# EAGLE design rp2040 (EAGLE 9.5.1)
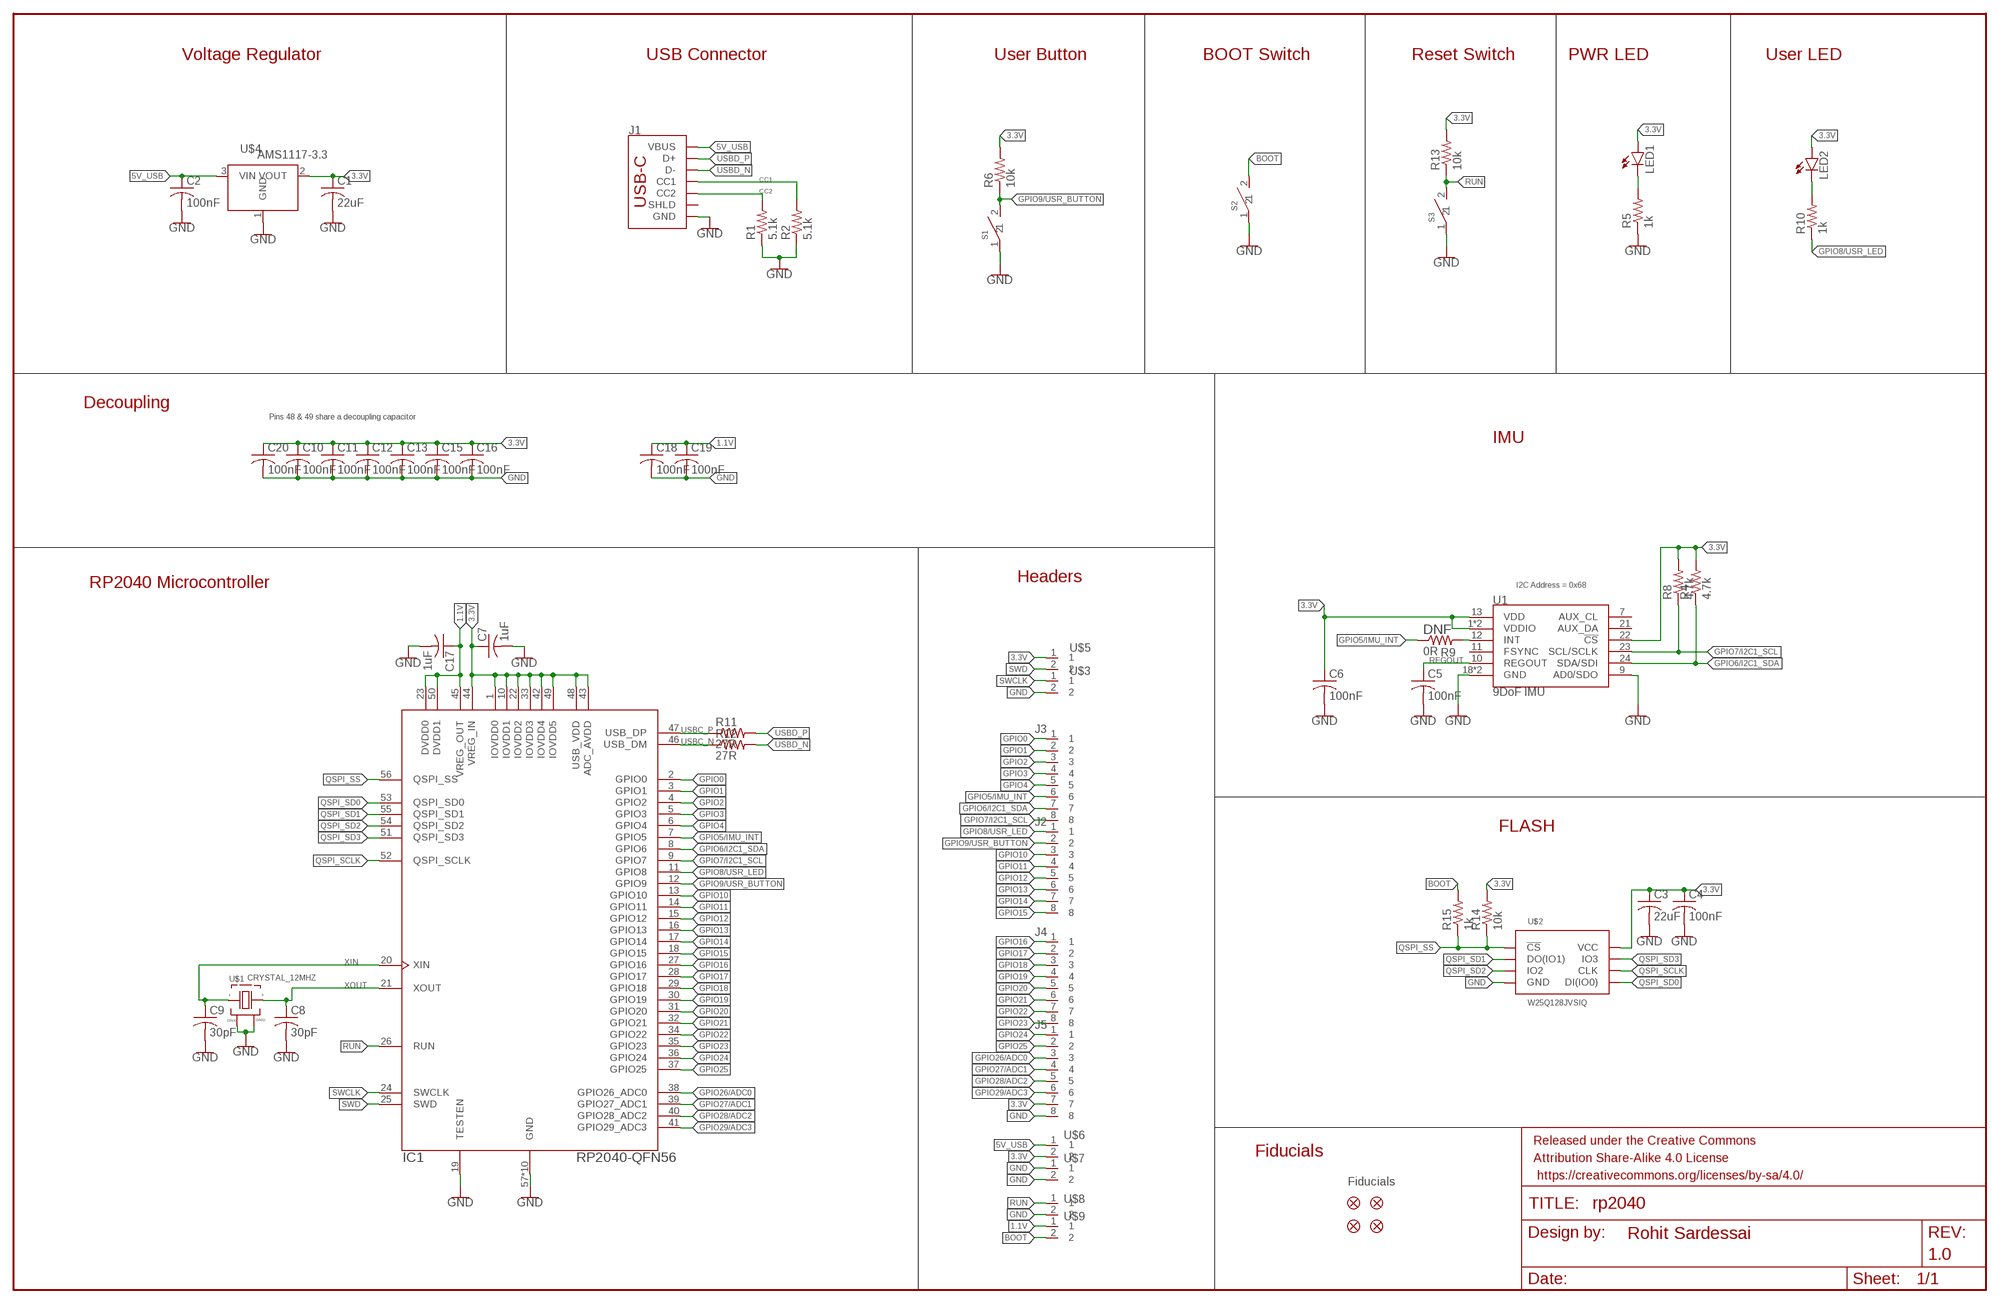
[diagram p0: schematic, sheet 1]

## Parts
C1  22uF  C-USC0603  [C0603]
C2  100nF  C-USC0603  [C0603]
C3  22uF  C-USC0402  [C0402]
C4  100nF  C-USC0402  [C0402]
C5  100nF  C-USC0402  [C0402]
C6  100nF  C-USC0402  [C0402]
C7  1uF  C-USC0402  [C0402]
C8  30pF  C-USC0402  [C0402]
C9  30pF  C-USC0402  [C0402]
C10  100nF  C-USC0402  [C0402]
C11  100nF  C-USC0402  [C0402]
C12  100nF  C-USC0402  [C0402]
C13  100nF  C-USC0402  [C0402]
C15  100nF  C-USC0402  [C0402]
C16  100nF  C-USC0402  [C0402]
C17  1uF  C-USC0402  [C0402]
C18  100nF  C-USC0402  [C0402]
C19  100nF  C-USC0402  [C0402]
C20  100nF  C-USC0402  [C0402]
FD1  FIDUCIAL1X2  [FIDUCIAL-1X2]
FD2  FIDUCIAL1X2  [FIDUCIAL-1X2]
FD3  FIDUCIAL1X2  [FIDUCIAL-1X2]
FD4  FIDUCIAL1X2  [FIDUCIAL-1X2]
FRAME1  FRAME-LEDGERNO_FOOTPRINT  [DUMMY]
IC1  RP2040-QFN56  [RP2040-QFN-56]
J1  USB_C_4-LAYER_PADS  [USB-C-16P_4LAYER-PADS]
J2  1X6_2.5MM  [1X06_2.5MM]
J3  1X6_2.5MM  [1X06_2.5MM]
J4  1X6_2.5MM  [1X06_2.5MM]
J5  1X6_2.5MM  [1X06_2.5MM]
LED1  LEDCHIPLED_0603  [CHIPLED_0603]
LED2  LEDCHIPLED_0603  [CHIPLED_0603]
R1  5.1k  R-US_R0402  [R0402]
R2  5.1k  R-US_R0402  [R0402]
R4  4.7k  R-US_R0402  [R0402]
R5  1k  R-US_R0402  [R0402]
R6  10k  R-US_R0402  [R0402]
R8  4.7k  R-US_R0402  [R0402]
R9  0R  R-US_R0402  [R0402]
R10  1k  R-US_R0402  [R0402]
R11  27R  R-US_R0402  [R0402]
R12  27R  R-US_R0402  [R0402]
R13  10k  R-US_R0402  [R0402]
R14  10k  R-US_R0402  [R0402]
R15  1k  R-US_R0402  [R0402]
S1  TS-1088-AR02016  [PUSH_SW_SMD]
S2  TS-1088-AR02016  [PUSH_SW_SMD]
S3  TS-1088-AR02016  [PUSH_SW_SMD]
U1  9DoF IMU  MPU-9250  [QFN24-3X3]
U$1  CRYSTAL_12MHZ  [CRYSTAL_12MHZ]
U$2  W25Q128JVSIQ  [SOIC8-208MIL]
U$3  1X2_2.5MM  [1X02_2.5MM]
U$4  AMS1117-3.3  [SOT-223]
U$5  1X2_2.5MM  [1X02_2.5MM]
U$6  1X2_2.5MM  [1X02_2.5MM]
U$7  1X2_2.5MM  [1X02_2.5MM]
U$8  1X2_2.5MM  [1X02_2.5MM]
U$9  1X2_2.5MM  [1X02_2.5MM]

## Nets
1.1V: C17.1 C18.1 C19.1 IC1.23(DVDD0) IC1.45(VREG_OUT) IC1.50(DVDD1) U$9.1
3.3V: C1.1 C3.1 C4.1 C6.1 C7.1 C10.1 C11.1 C12.1 C13.1 C15.1 C16.1 C20.1 IC1.1(IOVDD0) IC1.10(IOVDD1) IC1.22(IOVDD2) IC1.33(IOVDD3) IC1.42(IOVDD4) IC1.43(ADC_AVDD) IC1.44(VREG_IN) IC1.48(USB_VDD) IC1.49(IOVDD5) J5.7 LED1.A LED2.A R4.2 R6.2 R8.2 R13.2 R14.2 U1.1(VDDIO) U1.8(VDDIO) U1.13(VDD) U1.22(!CS) U$2.8(VCC) U$4.2(VOUT) U$5.1 U$6.2
5V_USB: C2.1 J1.VBUS1(VBUS) J1.VBUS2(VBUS) U$4.3(VIN) U$6.1
BOOT: R15.2 S2.2 U$9.2
CC1: J1.A5(CC1) R2.2
CC2: J1.B5(CC2) R1.2
GND: C1.2 C2.2 C3.2 C4.2 C5.2 C6.2 C7.2 C8.2 C9.2 C10.2 C11.2 C12.2 C13.2 C15.2 C16.2 C17.2 C18.2 C19.2 C20.2 IC1.19(TESTEN) IC1.57(GND) IC1.58(GND) IC1.59(GND) IC1.60(GND) IC1.61(GND) IC1.62(GND) IC1.63(GND) IC1.64(GND) IC1.65(GND) IC1.66(GND) J1.GND J1.GND2(GND) J5.8 R1.1 R2.1 R5.1 S1.1 S2.1 S3.1 U1.9(AD0/SDO) U1.18(GND) U1.20(GND) U$1.2(GND) U$1.4(GND) U$2.4(GND) U$3.2 U$4.1(GND) U$7.1 U$7.2 U$8.2
GPIO0: IC1.2(GPIO0) J3.1
GPIO1: IC1.3(GPIO1) J3.2
GPIO2: IC1.4(GPIO2) J3.3
GPIO3: IC1.5(GPIO3) J3.4
GPIO4: IC1.6(GPIO4) J3.5
GPIO5/IMU_INT: IC1.7(GPIO5) J3.6 R9.1
GPIO6/I2C1_SDA: IC1.8(GPIO6) J3.7 R4.1 U1.24(SDA/SDI)
GPIO7/I2C1_SCL: IC1.9(GPIO7) J3.8 R8.1 U1.23(SCL/SCLK)
GPIO8/USR_LED: IC1.11(GPIO8) J2.1 R10.1
GPIO9/USR_BUTTON: IC1.12(GPIO9) J2.2 R6.1 S1.2
GPIO10: IC1.13(GPIO10) J2.3
GPIO11: IC1.14(GPIO11) J2.4
GPIO12: IC1.15(GPIO12) J2.5
GPIO13: IC1.16(GPIO13) J2.6
GPIO14: IC1.17(GPIO14) J2.7
GPIO15: IC1.18(GPIO15) J2.8
GPIO16: IC1.27(GPIO16) J4.1
GPIO17: IC1.28(GPIO17) J4.2
GPIO18: IC1.29(GPIO18) J4.3
GPIO19: IC1.30(GPIO19) J4.4
GPIO20: IC1.31(GPIO20) J4.5
GPIO21: IC1.32(GPIO21) J4.6
GPIO22: IC1.34(GPIO22) J4.7
GPIO23: IC1.35(GPIO23) J4.8
GPIO24: IC1.36(GPIO24) J5.1
GPIO25: IC1.37(GPIO25) J5.2
GPIO26/ADC0: IC1.38(GPIO26_ADC0) J5.3
GPIO27/ADC1: IC1.39(GPIO27_ADC1) J5.4
GPIO28/ADC2: IC1.40(GPIO28_ADC2) J5.5
GPIO29/ADC3: IC1.41(GPIO29_ADC3) J5.6
N$1: LED1.C R5.2
N$5: R9.2 U1.12(INT)
N$6: LED2.C R10.2
QSPI_SCLK: IC1.52(QSPI_SCLK) U$2.6(CLK)
QSPI_SD0: IC1.53(QSPI_SD0) U$2.5(DI(IO0))
QSPI_SD1: IC1.55(QSPI_SD1) U$2.2(DO(IO1))
QSPI_SD2: IC1.54(QSPI_SD2) U$2.3(IO2)
QSPI_SD3: IC1.51(QSPI_SD3) U$2.7(IO3)
QSPI_SS: IC1.56(QSPI_SS) R14.1 R15.1 U$2.1(!CS)
REGOUT: C5.1 U1.10(REGOUT)
RUN: IC1.26(RUN) R13.1 S3.2 U$8.1
SWCLK: IC1.24(SWCLK) U$3.1
SWD: IC1.25(SWD) U$5.2
USBC_N: IC1.46(USB_DM) R12.1
USBC_P: IC1.47(USB_DP) R11.1
USBD_N: J1.A7(D-) J1.B7(D-) R12.2
USBD_P: J1.A6(D+) J1.B6(D+) R11.2
XIN: C9.1 IC1.20(XIN) U$1.1
XOUT: C8.1 IC1.21(XOUT) U$1.3
Unconnected: J1.SHLD1(SHLD) J1.SHLD2(SHLD) J1.SHLD3(SHLD) J1.SHLD4(SHLD) U1.7(AUX_CL) U1.11(FSYNC) U1.21(AUX_DA)

## Notes on the sheet
- Voltage Regulator | USB Connector | User Button | BOOT Switch | Reset Switch | PWR LED | User LED
- Decoupling
- Pins 48 & 49 share a decoupling capacitor
- IMU
- Headers
- RP2040 Microcontroller | I2C Address = 0x68
- DNF
- FLASH
- Fiducials
- Fiducials

## Library data of the parts
C1-C13 C15-C20 = rcl:C-US: CAPACITOR, American symbol; SPICEPREFIX: C
FD1-FD4 = SparkFun-Aesthetics:FIDUCIAL: Fiducial Alignment Points Point-of-reference for pick-and-place machines and other optical instruments.
FRAME1 = SparkFun-Aesthetics:FRAME-LEDGER: Schematic Frame - Ledger Standard 11x14 US Ledger frame; DESIGNER: Rohit Sardessai; REV: 1.0
IC1 = RPipico:RP2040-QFN56
J1 = SparkFun-Connectors:USB_C: USB Type C 16Pin Connector Super Speed pins not available on the 16-pin purely SMD connector so this part is best for USB 2.0 implementations. D1 and D2 are tied together enabling D+/- no matter which way the cable is plugged into the connector. The two channel configuration pins (CC1/2) are exposed. These are normally connected to ground via 5.1k resistors but can be reconfigured for high current/high power applications. **4-LAYER BOARD WARNING!!** If designing 4-layer board, make sure to select the variant _4-LAYER-ISOLATED. The linked footprint (USB-C-16-4LAYER-ISOLATED) includes some very necessary cutout polygons in the inner layers (2 and 15). This prevents the PTH mounting shield legs on the USB connector from electrically connecting any other polygons on the inner layers (usually VCC and GND).; PROD_ID: CONN-14122
J2-J5 = rp2040:1X6_2.5MM: 1 x 6 2.5mm pitch: 2.54 mm Castellated Holes
LED1 LED2 = led:LED: LED OSRAM: - CHIPLED LG R971, LG N971, LY N971, LG Q971, LY Q971, LO R971, LY R971 LH N974, LH R974 LS Q976, LO Q976, LY Q976 LO Q996 - Hyper CHIPLED LW Q18S LB Q993, LB Q99A, LB R99A - SideLED LS A670, LO A670, LY A670, LG A670, LP A670 LB A673, LV A673, LT A673, LW A673 LH A674 LY A675 LS A676, LA A676, LO A676, LY A676, LW A676 LS A679, LY A679, LG A679 - Hyper Micro SIDELED® LS Y876, LA Y876, LO Y876, LY Y876 LT Y87S - SmartLED LW L88C, LW L88S LB L89C, LB L89S, LG L890 LS L89K, LO L89K, LY L89K LS L896, LA L896, LO L896, LY L896 - TOPLED LS T670, LO T670, LY T670, LG T670, LP T670 LSG T670, LSP T670, LSY T670, LOP T670, LYG T670 LG T671, LOG T671, LSG T671 LB T673, LV T673, LT T673, LW T673 LH T674 LS T676, LA T676, LO T676, LY T676, LB T676, LH T676, LSB T676, LW T676 LB T67C, LV T67C, LT T67C, LS T67K, LO T67K, LY T67K, LW E67C LS E67B, LA E67B, LO E67B, LY E67B, LB E67C, LV E67C, LT E67C LW T67C LS T679, LY T679, LG T679 LS T770, LO T770, LY T770, LG T770, LP T770 LB T773, LV T773, LT T773, LW T773 LH T774 LS E675, LA E675, LY E675, LS T675 LS T776, LA T776, LO T776, LY T776, LB T776 LHGB T686 LT T68C, LB T68C - Hyper Mini TOPLED® LB M676 - Mini TOPLED Santana® LG M470 LS M47K, LO M47K, LY M47K Source: http://www.osram.convergy.de LUXEON: - LUMILED® LXK2-PW12-R00, LXK2-PW12-S00, LXK2-PW14-U00, LXK2-PW14-V00 LXK2-PM12-R00, LXK2-PM12-S00, LXK2-PM14-U00 LXK2-PE12-Q00, LXK2-PE12-R00, LXK2-PE12-S00, LXK2-PE14-T00, LXK2-PE14-U00 LXK2-PB12-K00, LXK2-PB12-L00, LXK2-PB12-M00, LXK2-PB14-N00, LXK2-PB14-P00, LXK2-PB14-Q00 LXK2-PR12-L00, LXK2-PR12-M00, LXK2-PR14-Q00, LXK2-PR14-R00 LXK2-PD12-Q00, LXK2-PD12-R00, LXK2-PD12-S00 LXK2-PH12-R00, LXK2-PH12-S00 LXK2-PL12-P00, LXK2-PL12-Q00, LXK2-PL12-R00 Source: www.luxeon.com KINGBRIGHT: KA-3528ASYC Source: www.kingbright.com
R1 R2 R4-R6 R8-R15 = rcl:R-US_: RESISTOR, American symbol; SPICEPREFIX: R
S1-S3 = rp2040:TS-1088-AR02016: Tactile Switch Push Button, SMD Manufacturer: XUNPU MFR.Part: #TS-1088-AR02016 JLCPCB Part: #C720477 Package: SMD_3×4×2.0 Description: SMD,3×4×2.0mm Tactile Switches ROHS Datasheet <https://datasheet.lcsc.com/lcsc/2008221234_XUNPU-TS-1088-AR02016_C720477.pdf>
U1 = SparkFun-Sensors:MPU-9250: MPU-9250 9 Degree of Freedom IMU System in Package that contains MPU-6500 & AK8963 NC pin 19. 2-6 & 14-17 not internally connected. May be used for PCB trace routing. Datasheet <https://cdn.sparkfun.com/assets/learn_tutorials/5/5/0/MPU9250REV1.0.pdf> SparkFun Products: SparkFun 9DoF Razor IMU M0 <https://www.sparkfun.com/products/14001> SparkFun IMU Breakout - MPU-9250 <https://www.sparkfun.com/products/13762>; PROD_ID: IC-13192
U$1 = rp2040:CRYSTAL_12MHZ: 12MHz Crystal Oscillator Manufacturer: Yangxing Tech MFR.Part: #X322512MSB4SI JLCPCB Part: #C9002 Package: SMD-3225_4P Description: SMD3225-4P Crystals ROHS Datasheet <https://datasheet.lcsc.com/lcsc/2103291203_Yangxing-Tech-X322512MSB4SI_C9002.pdf>
U$2 = rp2040:W25Q128JVSIQ: FLASH SPI - Dual/Quad I/O 128Mb (16M x 8) Non-Volatile Manufacturer: Winbond Elec MFR.Part: #W25Q128JVSIQ JLCPCB Part: #C97521 Package: SOIC-8_5.3x5.3x1.27P Description: FLASH SPI - Dual/Quad I/O 128Mb (16M x 8) Non-Volatile SOIC-8_208mil NOR FLASH ROHS Datasheet <https://datasheet.lcsc.com/lcsc/1811142111_Winbond-Elec-W25Q128JVSIQ_C97521.pdf>
U$3 U$5-U$9 = rp2040:1X2_2.5MM: 1 x 2 2.5mm pitch: 2.54 mm Castellated Holes
U$4 = rp2040:AMS1117-3.3: 3.3V SOT-223 Linear Voltage Regulator Manufacturer: Advanced Monolithic Systems MFR.Part: #AMS1117-3.3 JLCPCB Part: #C6186 Package: SOT-223 Description: 15V 1.3V @ 800mA - - Fixed 3.3V SOT-223 Linear Voltage Regulators (LDO) ROHS Datasheet <https://datasheet.lcsc.com/lcsc/1811142212_Advanced-Monolithic-Systems-AMS1117-3.3_C6186.pdf>

## Board
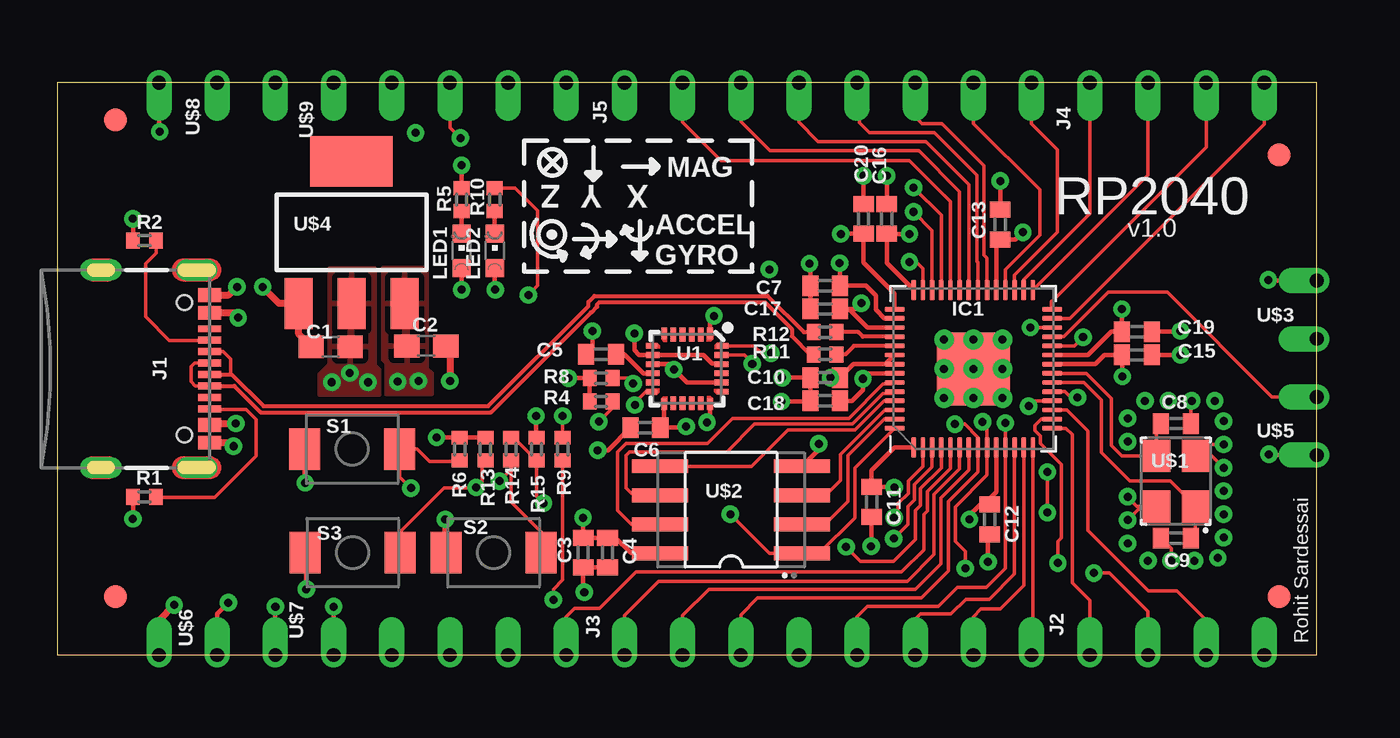
[diagram p1: board, top side]
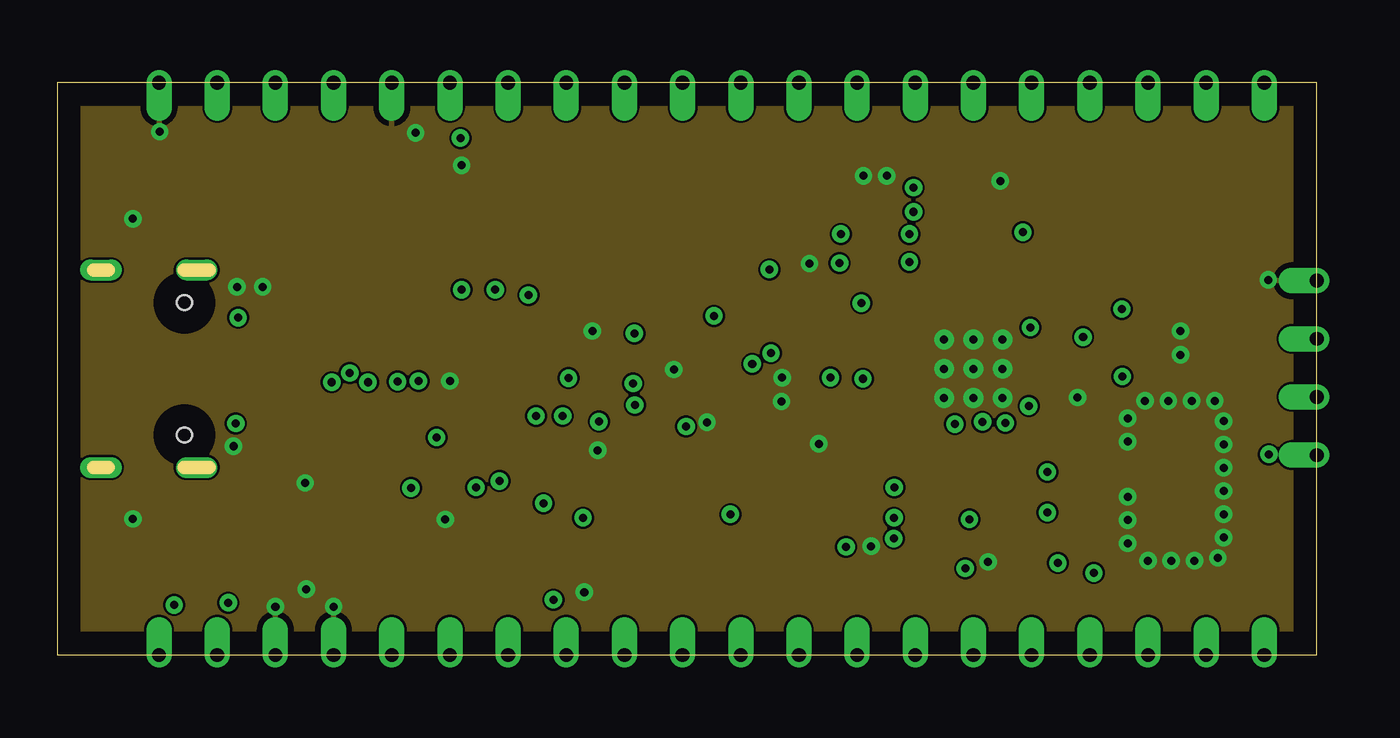
[diagram p2: board, inner layer Route2]
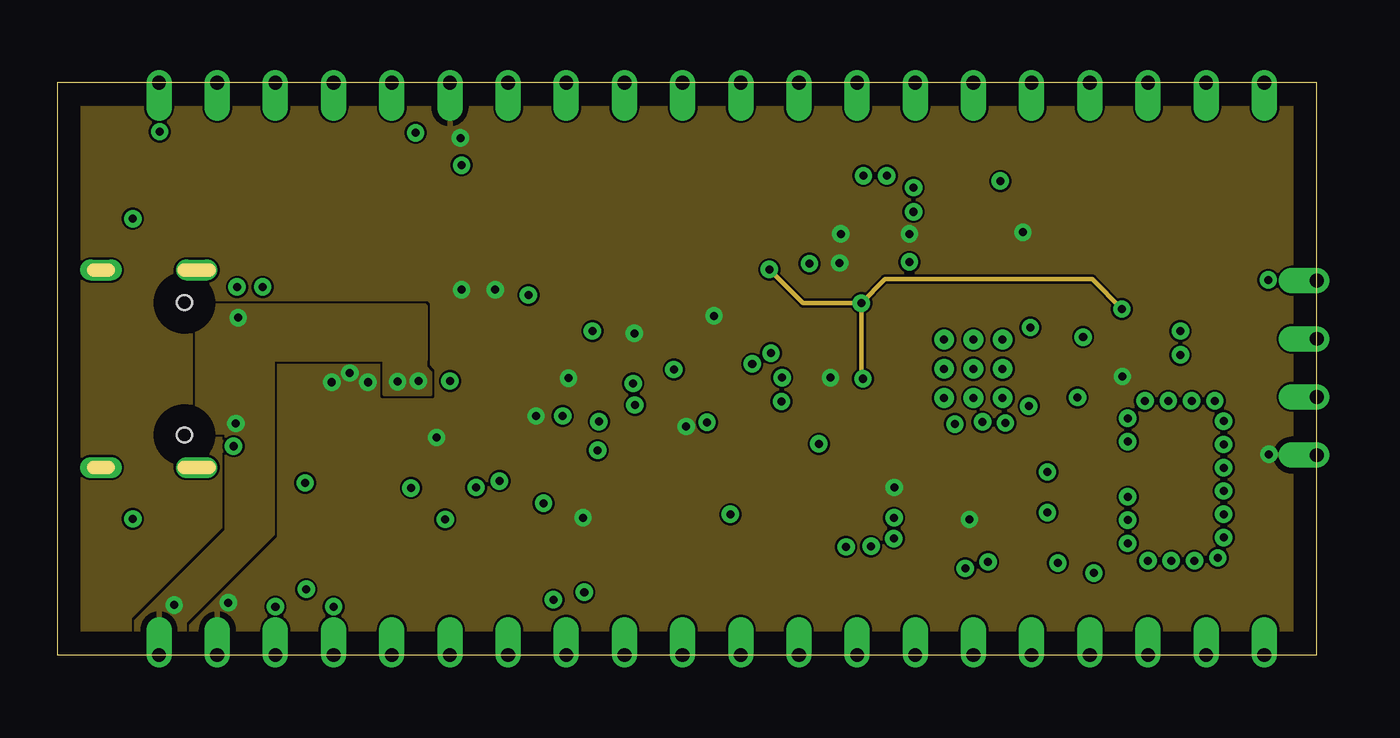
[diagram p3: board, inner layer Route15]
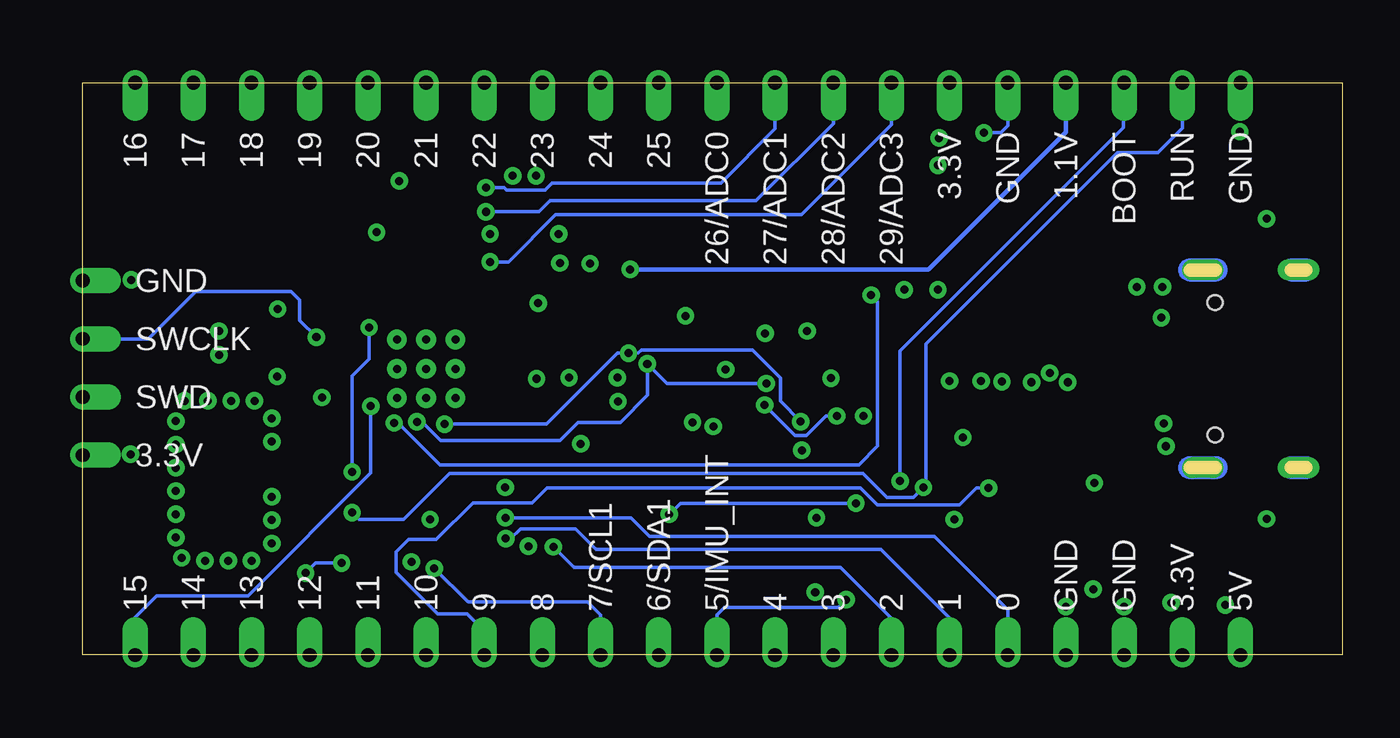
[diagram p4: board, bottom side, seen from below]

Size 55 x 25 mm. Coordinates in mm from the lower left corner, seen from the top.
Outline: 0,0 55,0 55,25 0,25 0,0
Copper layers (1+2*15+16): Top 0.035mm / dielectric 0.2mm / Route2 0.0175mm / dielectric 1.065mm / Route15 0.0175mm / dielectric 0.2mm / Bottom 0.035mm
Design rules "default *": minimum track width 6mil, minimum drill 0.35mm, track to track 4mil, track to pad 6mil, pad to pad 6mil, via to via 6mil, smd to smd 6mil, copper to edge 40mil, drill to drill 6mil, minimum pad ring 10mil, minimum via ring 8mil, stop-mask expansion 4mil, vias tented up to drill 0mil, thermal gap 10mil

### Footprints (pad centres in the part's own frame; a part is rotated, then mirrored left to right if it is on the bottom)
C0603 = smd 1.1 x 1: 1 -0.85,0; 2 0.85,0
C0402 = smd 0.7 x 0.9: 1 -0.65,0; 2 0.65,0
FIDUCIAL-1X2 = smd 1 x 1: 1 0,0
RP2040-QFN-56 = smd 0.875 x 0.2: 1 -3.438,2.6; 2 -3.438,2.2; 3 -3.438,1.8; 4 -3.438,1.4; 5 -3.438,1; 6 -3.438,0.6; 7 -3.438,0.2; 8 -3.438,-0.2; 9 -3.438,-0.6; 10 -3.438,-1; 11 -3.438,-1.4; 12 -3.438,-1.8; 13 -3.438,-2.2; 14 -3.438,-2.6; 29 3.438,-2.6; 30 3.438,-2.2; 31 3.438,-1.8; 32 3.438,-1.4; 33 3.438,-1; 34 3.438,-0.6; 35 3.438,-0.2; 36 3.438,0.2; 37 3.438,0.6; 38 3.438,1; 39 3.438,1.4; 40 3.438,1.8; 41 3.438,2.2; 42 3.438,2.6 | smd 0.2 x 0.875: 15 -2.6,-3.438; 16 -2.2,-3.438; 17 -1.8,-3.438; 18 -1.4,-3.438; 19 -1,-3.438; 20 -0.6,-3.438; 21 -0.2,-3.438; 22 0.2,-3.438; 23 0.6,-3.438; 24 1,-3.438; 25 1.4,-3.438; 26 1.8,-3.438; 27 2.2,-3.438; 28 2.6,-3.438; 43 2.6,3.438; 44 2.2,3.438; 45 1.8,3.438; 46 1.4,3.438; 47 1,3.438; 48 0.6,3.438; 49 0.2,3.438; 50 -0.2,3.438; 51 -0.6,3.438; 52 -1,3.438; 53 -1.4,3.438; 54 -1.8,3.438; 55 -2.2,3.438; 56 -2.6,3.438 | smd 3.2 x 3.2: 57 0,0 | drill 0.35 pad 0.6: 58 -1.275,1.275; 59 0,1.275; 60 1.275,1.275; 61 -1.275,0; 62 0,0; 63 1.275,0; 64 -1.275,-1.275; 65 0,-1.275; 66 1.275,-1.275
USB-C-16P_4LAYER-PADS = smd 0.3 x 1: A5 -1.25,-0.34; A6 -0.25,-0.34; A7 0.25,-0.34; A8 1.25,-0.34; B5 1.75,-0.34; B6 0.75,-0.34; B7 -0.75,-0.34; B8 -1.75,-0.34 | smd 0.6 x 1: GND -3.225,-0.34; GND2 3.225,-0.34; VBUS1 -2.45,-0.34; VBUS2 2.45,-0.34 | drill 0.4 pad 0.6 long: SHLD1 -4.318,-0.915; SHLD2 4.318,-0.915; SHLD3 -4.318,-5.095; SHLD4 4.318,-5.095 | hole 0.65: -2.89,-1.445; 2.89,-1.445
1X06_2.5MM = drill 0.6 offset: 1 0,8.89; 2 0,6.35; 3 0,3.81; 4 0,1.27; 5 0,-1.27; 6 0,-3.81; 7 0,-6.35; 8 0,-8.89
CHIPLED_0603 = smd 0.8 x 0.8: A 0,-0.75; C 0,0.75
R0402 = smd 0.6 x 0.7: 1 -0.5,0; 2 0.5,0
PUSH_SW_SMD = smd 1.35 x 1.8: 1 -2.075,0; 2 2.075,0
QFN24-3X3 = smd 0.495 x 0.25: 1 -1.552,1; 6 -1.552,-1; 13 1.552,-1; 18 1.552,1 | smd 0.6 x 0.25: 2 -1.5,0.6; 3 -1.5,0.2; 4 -1.5,-0.2; 5 -1.5,-0.6; 14 1.5,-0.6; 15 1.5,-0.2; 16 1.5,0.2; 17 1.5,0.6 | smd 0.25 x 0.495: 7 -1,-1.552; 12 1,-1.552; 19 1,1.552; 24 -1,1.552 | smd 0.25 x 0.6: 8 -0.6,-1.5; 9 -0.2,-1.5; 10 0.2,-1.5; 11 0.6,-1.5; 20 0.6,1.5; 21 0.2,1.5; 22 -0.2,1.5; 23 -0.6,1.5
CRYSTAL_12MHZ = smd 1.4 x 1.2: 1 -1.1,-0.85; 2 1.1,-0.85; 3 1.1,0.85; 4 -1.1,0.85
SOIC8-208MIL = smd 2.45 x 0.6: 1 -3.1,1.905; 2 -3.1,0.635; 3 -3.1,-0.635; 4 -3.1,-1.905; 5 3.1,-1.905; 6 3.1,-0.635; 7 3.1,0.635; 8 3.1,1.905
1X02_2.5MM = drill 0.6 offset: 1 0,1.27; 2 0,-1.27
SOT-223 = smd 1.219 x 2.235: 1 -2.311,-3.099; 2 0,-3.099; 3 2.311,-3.099 | smd 3.6 x 2.2: 4 0,3.099

### Placement (x,y rotation side)
C1  11.94,13.46 180 top
C2  16.12,13.49 0 top
C3  22.96,4.47 270 top
C4  24.03,4.47 270 top
C5  23.75,13.13 180 top
C6  25.68,9.93 180 top
C7  33.53,16.13 180 top
C8  48.84,10.11 0 top
C9  48.84,5.11 180 top
C10  33.53,12.12 180 top
C11  35.56,6.68 270 top
C12  40.72,5.92 270 top
C13  41.17,18.8 90 top
C15  47.14,13.11 0 top
C16  36.22,19.05 90 top
C17  33.53,15.11 180 top
C18  33.53,11.1 180 top
C19  47.14,14.12 0 top
C20  35.2,19.05 90 top
FD1  53.34,21.84 0 top
FD2  53.34,2.54 0 top
FD3  2.54,23.37 0 top
FD4  2.54,2.54 0 top
FRAME1  52.65,18.59 0 top
IC1  40,12.5 90 top
J1  7,12.5 270 top
J2  43.81,0 90 top
J3  23.5,0 90 top
J4  43.81,25 270 top
J5  23.5,25 270 top
LED1  17.65,17.65 0 top
LED2  19.1,17.65 0 top
R1  3.81,6.9 0 top
R2  3.81,18.1 0 top
R4  23.75,11.07 180 top
R5  17.65,19.89 270 top
R6  17.58,8.99 90 top
R8  23.75,12.09 180 top
R9  22.07,8.99 90 top
R10  19.1,19.89 270 top
R11  33.53,13.13 180 top
R12  33.53,14.1 180 top
R13  18.69,8.99 90 top
R14  20.93,8.99 90 top
R15  19.81,8.99 270 top
S1  12.88,8.99 0 top
S2  19.05,4.47 0 top
S3  12.9,4.47 0 top
U1  27.5,12.5 270 top
U$1  48.84,7.59 90 top
U$2  29.42,6.34 180 top
U$3  55,15.08 180 top
U$4  12.85,18.45 0 top
U$5  55,10 180 top
U$6  5.71,0 90 top
U$7  10.79,0 90 top
U$8  5.71,25 270 top
U$9  10.79,25 270 top

### Tracks (layer width: path | path; a pad name or v marks a point on that pad's centre or on a via)
1.1V  (via drill 0.35)
  Top 0.203: IC1.23 45,13.1 46.02,14.12 C19.1 46.49,15.1 v46.48,15.11 | IC1.45 35.38,14.3 34.57,15.11 C17.1 34.85,15.11 v35.11,15.37 | C18.1 34.7,11.1 35.18,11.58 v35.18,12.06 35.41,12.3 IC1.50
  Route15 0.203: v35.11,15.37 35.11,12.14 v35.18,12.06 | v35.11,15.37 36.15,16.41 45.19,16.41 v46.48,15.11 | v35.11,15.37 32.56,15.37 v31.09,16.84
  Bottom 0.203: v31.09,16.84 18.06,16.84 12.06,22.84 U$9.1
3.3V  (via drill 0.35)
  Top 0.152: 52.94,8.73 v52.91,8.76 | J5.7 17.14,23.04 v17.6,22.58
  Top 0.203: LED1.A v17.65,15.95 | LED2.A 19.1,15.98 v19.13,15.95 | v34.16,17.12 34.18,17.11 C7.1 35.31,16.13 35.74,15.7 35.74,15.09 36.12,14.7 IC1.44 | IC1.43 36.56,15.79 35.2,17.14 C20.1 34.22,18.4 v34.21,18.39 | IC1.42 36.22,17.12 C16.1 36.23,18.39 v37.21,18.39 | IC1.33 41,17.97 C13.1 41.84,18.15 v42.16,18.47 | IC1.22 45.32,12.7 45.73,13.11 C15.1 46.51,13.09 v46.51,12.17 | IC1.10 41,7.12 40.72,6.84 C12.1 40.3,6.57 39.83,6.1 v39.83,5.92 | IC1.1 36.56,9.06 35.56,8.07 C11.1 36.54,7.33 v36.55,7.32 | IC1.49 36.16,12.7 | 36.16,12.7 34.76,12.7 C10.1 v33.76,12.12 | IC1.48 36.16,12.7 | U$2.8 26.3,4.46 25.05,4.46 24.38,5.12 C4.1 C3.1 v22.96,5.99 | U1.13 26.5,10.1 C6.1 27.41,9.93 v27.46,9.98 | U1.22 28.98,12.72 28.59,12.72 28.22,13.1 U1.8 25.41,13.1 25.2,13.31 v25.2,14.05 | U1.1 28.5,14.63 v28.68,14.81 | U$5.1 52.94,8.73 | U$6.2 6.99,1.8 v7.47,2.29 | v16.56,9.5 v16.57,9.49 R6.2 R13.2 | R14.2 20.9,9.52 v20.9,10.44 | R4.2 R8.2 v22.33,12.09
  other vias: 12.78,12.32 11.99,11.91 13.56,11.91
  pour Route15 (rank 5): -1.7,26.67 -1.7,-2.54 57.28,-2.54 57.28,26.67
  pour Top: 11.86,16.89 11.86,12.7 11.43,12.27 11.43,11.35 14.07,11.35 14.07,12.47 13.87,12.67 13.87,16.89
5V_USB  (via drill 0.35)
  Top 0.305: U$6.1 4.45,1.52 v5.11,2.18 | J1.VBUS2 6.72,10.11 v7.8,10.11 | J1.VBUS1 7.68,14.95 v7.9,14.73
  other vias: 14.86,11.94 15.77,11.96
  pour Route15: 6.1,9.7 7.29,9.7 7.37,9.63 7.37,5.44 3.43,1.5 3.43,-0.66 5.59,-0.66 5.59,1.42 9.42,5.26 9.42,12.88 16.1,12.88 16.1,15.24 16.05,15.29 6.1,15.29
  pour Top: 14.35,11.38 14.35,12.73 14.2,12.88 14.2,16.92 16.15,16.92 16.15,12.52 16.36,12.32 16.36,11.38
  pour Route15: 16.08,15.24 16.08,12.57 16.31,12.34 16.31,11.38 14.27,11.38 14.27,15.27 16.05,15.27
BOOT  (via drill 0.35)
  Top 0.152: S2.2 21.12,5.37 19.81,6.68 R15.2 19.81,8.1 v19.3,7.59
  Bottom 0.152: U$9.2 9.55,24.98 9.55,23.04 19.3,13.28 v19.3,7.59
CC1
  Top 0.152: R2.2 4.31,17.55 3.86,17.09 3.86,14.78 4.89,13.74 J1.A5
CC2
  Top 0.152: J1.B5 6.69,10.72 8.25,10.72 8.68,10.28 8.68,8.69 6.88,6.89 R1.2
GND  (via drill 0.35)
  Top 0.152: C9.2 48.64,4.66 v48.64,4.12 | v46.74,6.91 47.15,6.5 U$1.4 47.34,6.5 v46.74,5.89 | C8.2 49.49,11.06 v49.53,11.1 | v50.93,9.2 50.19,9.2 U$1.2 50.41,8.7 v50.93,8.18 | IC1.19 44,11.5 44.25,11.25 v44.55,11.25
  Top 0.203: R5.1 v17.65,21.39 | C11.2 35.56,4.78 v35.53,4.75 | C12.2 40.64,5.19 v40.64,4.06 | C15.2 v49.05,13.11 | C19.2 49.02,14.12 v49.05,14.15 | v41.17,20.7 C13.2 | C16.2 v36.22,20.93 | C20.2 v35.2,20.93 | v33.25,9.22 33.25,8.97 U$2.4 | v31.62,11.07 32.85,11.07 C18.2 C10.2 v31.65,12.12 | v52.88,16.38 52.92,16.35 U$3.2 | U$7.2 v12.06,2.11 | S3.1 10.87,4.43 v10.87,2.87 | U$7.1 v9.53,2.11 | U$8.2 4.45,22.89 v4.47,22.86 | S1.1 10.8,7.54 v10.82,7.52 | S2.1 16.92,4.53 16.92,5.89 v16.94,5.92 | v23.01,2.74 22.96,2.79 C3.2 C4.2 | R1.1 3.31,5.95 v3.3,5.94 | R2.1 v3.31,19.04 v3.3,19.05 | U1.18 28.5,10.29 v28.37,10.16 | C6.2 24.04,8.94 v23.6,8.94 | U1.9 26.69,12.7 v26.92,12.47 27.49,11.9 U1.20 | C5.2 23.37,13.4 v23.37,14.15 | C17.2 C7.2 32.88,17.06 v32.84,17.09
  Top 0.305: J1.GND 7.5,15.72 v7.85,16.08 | J1.GND2 7.54,9.28 v7.7,9.12 | v8.97,16.08 9.69,15.36 U$4.1 10.54,14.01 C1.2 | C2.2 17.14,13.31 v17.14,11.96
  Bottom 0.152: J5.8 14.61,23.11 14.91,22.81 v15.65,22.81
  other vias: 46.74,9.32 46.74,10.34 47.5,11.1 48.51,11.1 50.55,11.1 50.93,10.21 50.93,7.16 50.93,6.15 50.93,5.13 50.67,4.24 49.66,4.11 47.62,4.11 46.74,4.88
  pour Route2 (rank 5): -1.24,26.04 -1.24,-1.91 56.52,-1.91 56.52,26.04
GPIO0  (via drill 0.35)
  Top 0.152: IC1.2 37.8,8.23 37.16,7.59 37.16,7.06 36.7,6.61 36.7,6.16 v36.54,5.99
  Bottom 0.152: J3.1 14.61,1.98 17.81,5.19 30.25,5.19 31.06,5.99 v36.54,5.99
GPIO1  (via drill 0.35)
  Top 0.152: IC1.3 38.2,8.2 37.44,7.44 37.44,6.78 37.15,6.49 37.15,5.71 v36.52,5.09
  Bottom 0.152: J3.2 17.14,1.63 20.14,4.62 32.59,4.62 33.48,5.51 35.89,5.51 36.31,5.09 v36.52,5.09
GPIO2  (via drill 0.35)
  Top 0.152: IC1.4 38.6,8.17 37.69,7.26 37.69,6.53 37.48,6.31 37.48,5.05 36.51,4.09 35.08,4.09 v34.44,4.72
  Bottom 0.152: v34.44,4.72 33.55,3.83 21.92,3.83 19.68,1.6 J3.3
GPIO3
  Top 0.152: IC1.5 39,8.14 38,7.14 38,6.3 37.83,6.13 37.83,4.59 36.87,3.63 25.27,3.63 23.67,2.03 22.58,2.03 22.23,1.68 J3.4
GPIO4
  Top 0.152: IC1.6 39.4,8.13 38.28,7.01 38.28,4.38 37.12,3.23 26.26,3.23 24.77,1.73 J3.5
GPIO5/IMU_INT  (via drill 0.35)
  Top 0.152: IC1.7 39.8,8.07 38.58,6.86 38.58,3.98 37.47,2.87 28.45,2.87 27.3,1.73 J3.6 | R9.1 22.07,3.28 21.67,2.87 v21.67,2.41
  Bottom 0.152: v21.67,2.41 22,2.08 26.98,2.08 27.3,1.75 J3.6
GPIO6/I2C1_SDA  (via drill 0.35)
  Top 0.152: v39.19,10.08 39.62,10.08 40.2,9.51 IC1.8 40.2,8 38.91,6.71 38.91,3.66 37.74,2.49 30.58,2.49 29.84,1.75 J3.7 | v31.17,13.18 30.74,13.18 30.42,13.5 U1.24 | R4.1 24.25,10.79 v23.65,10.19
  Bottom 0.152: v39.19,10.08 34.74,10.08 31.64,13.18 v31.17,13.18 30.74,13.18 30.6,13.32 25.76,13.32 24.54,12.11 24.54,11.09 v23.65,10.19
GPIO7/I2C1_SCL  (via drill 0.35)
  Top 0.152: v39.65,3.79 39.65,4.52 39.22,4.95 39.22,6.48 40.6,7.86 IC1.9 40.6,9.99 v40.41,10.18 | U1.23 30,13.1 30.34,12.76 v30.34,12.72 | R8.1 24.91,12.09 v25.15,11.86
  Bottom 0.152: v39.65,3.79 38.18,2.31 32.94,2.31 32.38,1.75 J3.8 | v40.41,10.18 40.18,10.18 39.37,9.37 34.15,9.37 33.37,10.16 31.52,10.16 30.33,11.35 30.33,12.7 | 30.33,12.7 v30.34,12.72 | v25.15,11.86 29.48,11.86 30.33,12.7
GPIO8/USR_LED  (via drill 0.35)
  Top 0.152: J2.1 34.92,1.68 35.38,2.13 38.48,2.13 39.3,2.95 40.57,2.95 41.4,3.78 IC1.11 v41.4,10.13 | R10.1 20,20.39 20.98,19.41 20.98,16.13 v20.57,15.72
  Bottom 0.152: v41.4,10.13 41.22,10.13 39.39,8.31 21.11,8.31 20.3,9.12 20.3,15.45 v20.57,15.72
GPIO9/USR_BUTTON  (via drill 0.35)
  Top 0.152: J2.2 37.47,1.57 37.68,1.79 39.03,1.79 39.67,2.44 40.69,2.44 41.8,3.55 IC1.12 | R6.1 17.54,8.46 16.26,8.46 15.72,8.99 S1.2 14.95,7.78 v15.44,7.29
  Bottom 0.152: v15.44,7.29 15.98,7.29 16.71,6.55 20.3,6.55 21.04,7.29 34.73,7.29 35.37,6.65 37.96,6.65 39.56,5.05 40.76,5.05 41.32,4.49 41.32,3.61 39.5,1.79 38.21,1.79 37.47,1.04 J2.2
GPIO10
  Top 0.152: J2.3 40.01,1.68 40.34,2.01 41.17,2.01 42.2,3.03 IC1.13
GPIO11
  Top 0.152: J2.4 42.6,0.06 IC1.14
GPIO12
  Top 0.152: J2.5 45.09,2.39 44.32,3.15 44.32,9.63 44.05,9.9 IC1.15
GPIO13  (via drill 0.35)
  Top 0.152: J2.6 47.62,1.91 45.95,3.58 v45.26,3.58 | IC1.16 42.96,10.3 42.7,10.03 42.7,9.8 42.93,9.56 42.93,9.24 43.84,8.33 43.84,5.11 43.69,4.95 v43.69,4.01
  Bottom 0.152: v43.69,4.01 44.83,4.01 v45.26,3.58
GPIO14
  Top 0.152: IC1.17 44.09,10.7 45.01,9.78 45.01,5.44 47.65,2.79 48.9,2.79 50.16,1.52 J2.7
GPIO15  (via drill 0.35)
  Top 0.152: IC1.18 42.65,11.1 v42.42,10.87
  Bottom 0.152: v42.42,10.87 42.42,7.95 47.78,2.59 51.77,2.59 52.7,1.65 J2.8
GPIO16
  Top 0.152: J4.1 52.7,23.19 44.22,14.7 IC1.27
GPIO17
  Top 0.152: J4.2 50.16,22.17 43.44,15.45
  Top 0.203: IC1.28 43.44,15.45
GPIO18
  Top 0.152: J4.3 47.62,20.96 IC1.29
GPIO19
  Top 0.152: IC1.30 42.2,16.39 45.09,19.28 J4.4
GPIO20
  Top 0.152: IC1.31 41.8,16.6 43.66,18.47 43.66,22.08 42.55,23.2 J4.5
GPIO21
  Top 0.152: J4.6 40.01,23.22 42.9,20.32 42.9,18.34 41.4,16.84 IC1.32
GPIO22
  Top 0.152: IC1.34 40.6,17.34 40.47,17.47 40.47,21.38 38.63,23.22 37.74,23.22 37.47,23.5 J4.7
GPIO23
  Top 0.152: IC1.35 40.2,17.15 40.16,17.19 40.16,20.95 38.3,22.81 35.46,22.81 35.03,23.24 35.03,24.9
  Top 0.203: J4.8 35.03,24.9
GPIO24
  Top 0.152: IC1.36 39.8,20.55 37.93,22.43 33.22,22.43 32.38,23.27 J5.1
GPIO25
  Top 0.152: IC1.37 39.4,20.24 37.62,22.02 31.11,22.02 29.84,23.29 J5.2
GPIO26/ADC0
  Top 0.152: IC1.38 39,19.8 37.21,21.59 28.98,21.59 27.3,23.27 J5.3
GPIO27/ADC1  (via drill 0.35)
  Top 0.152: IC1.39 38.6,19.2 v37.39,20.42
  Bottom 0.152: J5.4 24.77,22.99 27.13,20.62 34.49,20.62 34.82,20.3 36.48,20.3 36.6,20.42 v37.39,20.42
GPIO28/ADC2  (via drill 0.35)
  Top 0.152: IC1.40 38.2,18.54 v37.39,19.36
  Bottom 0.152: J5.5 22.23,23.22 25.6,19.84 34.59,19.84 35.08,19.36 v37.39,19.36
GPIO29/ADC3  (via drill 0.35)
  Top 0.152: IC1.41 37.8,16.88 37.52,17.17 v37.21,17.17
  Bottom 0.152: v37.21,17.17 36.4,17.17 34.34,19.23 23.62,19.23 19.68,23.16 J5.6
N$1
  Top 0.203: LED1.C R5.2
N$5  (via drill 0.35)
  Top 0.152: U1.12 25.7,11.5 25.22,11.02 v25.22,10.92 | v22.07,10.44 R9.2
  Bottom 0.152: v25.22,10.92 v25.22,10.91 23.9,9.59 23.4,9.59 22.54,10.44 v22.07,10.44
N$6
  Top 0.203: LED2.C R10.2
QSPI_SCLK
  Top 0.152: IC1.52 36.49,11.43 36.06,11.43 34.72,10.08 30.45,10.08 29.23,8.87 24.99,8.87 24.84,8.71 24.84,7.29 25.07,7.06 26.24,7.06 U$2.6
QSPI_SD0
  Top 0.152: IC1.53 36.09,11.1 34.82,9.83 31.9,9.83 30.32,8.24 U$2.5
QSPI_SD1
  Top 0.152: U$2.2 33.52,5.7 34.52,6.71 34.52,8.71 36.11,10.3 IC1.55
QSPI_SD2
  Top 0.152: IC1.54 36.14,10.71 34.19,8.76 34.19,7.62 33.54,6.97 U$2.3
QSPI_SD3
  Top 0.152: IC1.51 36.49,11.83 36.06,11.83 34.57,10.34 29.49,10.34 28.4,9.25 24.84,9.25 24.46,8.87 24.46,6.33 25.08,5.7 U$2.7
QSPI_SS  (via drill 0.35)
  Top 0.152: IC1.56 34.82,8.16 34.82,5.99 33.26,4.43 U$2.1 31.1,4.43 v29.39,6.14 | R15.1 19.93,9.49 R14.1 20.93,6.93 v21.23,6.63
  Bottom 0.152: v21.23,6.63 28.9,6.63 v29.39,6.14
REGOUT
  Top 0.203: C5.1 24.77,13.13 25.6,12.3 U1.10
RUN  (via drill 0.35)
  Top 0.152: S3.2 14.98,5.38 16.89,7.29 18.26,7.29 v18.29,7.32 18.54,7.57 18.54,8.34 R13.1 | v43.23,6.22 v43.23,7.99 | v42.49,14.3 IC1.26
  Bottom 0.152: v43.23,6.22 42.93,5.92 40.99,5.92 38.99,7.92 20.93,7.92 19.89,6.88 18.72,6.88 v18.29,7.32 18.19,7.41 18.19,13.59 9.83,21.95 8.05,21.95 6.99,23.01 U$8.1 | v43.23,7.99 43.23,12.19 42.49,12.93 v42.49,14.3
SWCLK  (via drill 0.35)
  Top 0.152: IC1.24 44.41,13.5 v44.79,13.88
  Bottom 0.152: v44.79,13.88 45.52,14.61 45.52,15.49 45.9,15.88 50.06,15.88 52.13,13.81 U$3.1
SWD
  Top 0.152: U$5.2 53.04,11.27 48.46,15.85 45.9,15.85 43.95,13.9 IC1.25
USBC_N
  Top 0.175: R12.1 34.98,14.1 35.17,13.9 IC1.46
USBC_P
  Top 0.175: R11.1 34.42,13.13 34.79,13.5 IC1.47
USBD_N
  Top 0.152: J1.B7 7.25,13.25 7.57,12.93 7.57,12.28 7.54,12.25
  Top 0.175: J1.A7 7.54,12.25 7.62,12.25 9,10.87 18.82,10.87 23.19,15.24 23.19,15.42 23.46,15.69 31.01,15.69 32.6,14.1 R12.2
USBD_P
  Top 0.152: J1.B6 6.03,11.75 5.84,11.94 5.84,12.6 5.99,12.75 J1.A6
  Top 0.175: R11.2 32.87,13.13 32.08,13.93 32.08,14.23 30.9,15.41 23.67,15.41 23.57,15.31 23.57,15.21 23.32,14.96 23.3,14.96 18.94,10.6 8.89,10.6 7.73,11.75 J1.B6
XIN
  Top 0.152: C9.1 49.69,5.3 U$1.1 48.59,7.59 46.84,7.59 45.59,8.84 45.59,11.14 44.83,11.9 IC1.20
XOUT
  Top 0.152: C8.1 47.99,9.91 U$1.3 46.47,8.7 46.02,9.14 46.02,11.2 44.93,12.3 IC1.21

### Text on the board
tPlace: MAG | Z | Y | X | ACCEL / GYRO
bPlace: GND | RUN | BOOT | 1.1V | GND | 3.3V | 29/ADC3 | 28/ADC2 | 27/ADC1 | 26/ADC0 | 25 | 24 | 23 | 22 | 21 | 20 | 19 | 18 | 17 | 16 | GND | SWCLK | SWD | 3.3V | 5V | 3.3V | GND | GND | 0 | 1 | 2 | 3 | 4 | 5/IMU_INT | 6/SDA1 | 7/SCL1 | 8 | 9 | 10 | 11 | 12 | 13 | 14 | 15
tNames: RP2040 | v1.0 | Rohit Sardessai